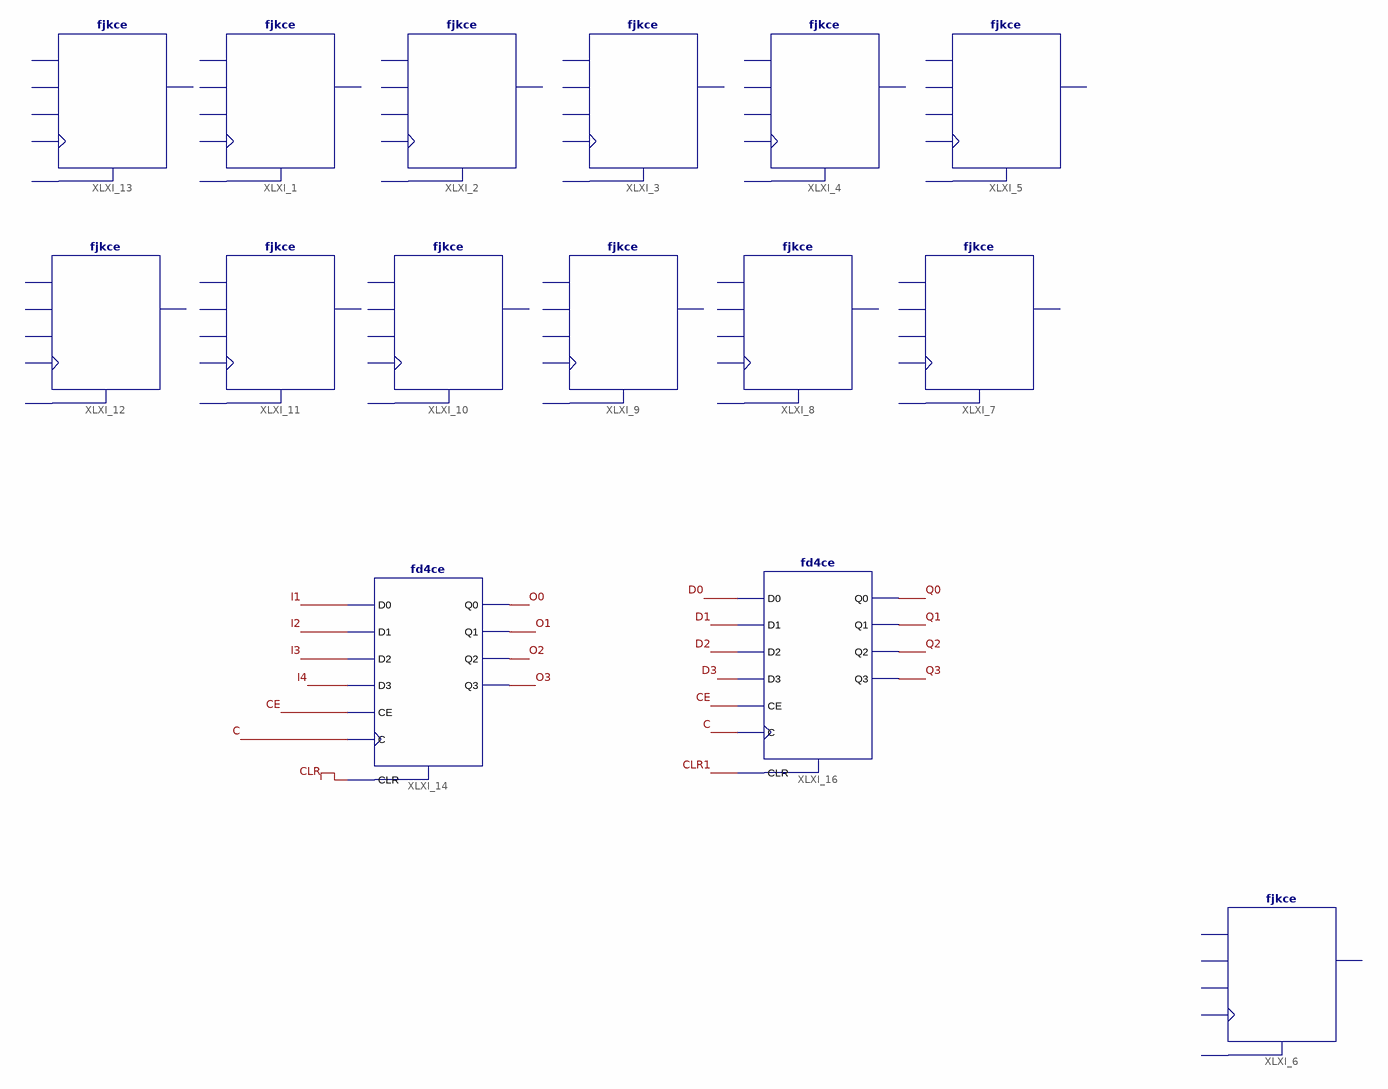
[diagram p0: schematic sheet 1]
// Xilinx ISE schematic inputProcessor.sch (spartan3e) as structural Verilog: 15 symbols, 0 ports
module inputProcessor (
);

  wire C, CE, CLR, CLR1, D0, D1, D2, D3, I1, I2, I3, I4, O0, O1, O2, O3, Q0, Q1, Q2, Q3;

  fjkce XLXI_1 ();  // open: C, CE, CLR, J, K, Q
  fjkce XLXI_2 ();  // open: C, CE, CLR, J, K, Q
  fjkce XLXI_3 ();  // open: C, CE, CLR, J, K, Q
  fjkce XLXI_4 ();  // open: C, CE, CLR, J, K, Q
  fjkce XLXI_5 ();  // open: C, CE, CLR, J, K, Q
  fjkce XLXI_7 ();  // open: C, CE, CLR, J, K, Q
  fjkce XLXI_8 ();  // open: C, CE, CLR, J, K, Q
  fjkce XLXI_9 ();  // open: C, CE, CLR, J, K, Q
  fjkce XLXI_10 ();  // open: C, CE, CLR, J, K, Q
  fjkce XLXI_11 ();  // open: C, CE, CLR, J, K, Q
  fjkce XLXI_12 ();  // open: C, CE, CLR, J, K, Q
  fjkce XLXI_13 ();  // open: C, CE, CLR, J, K, Q
  fd4ce XLXI_16 (.C(C), .CE(CE), .CLR(CLR1), .D0(D0), .D1(D1), .D2(D2), .D3(D3), .Q0(Q0), .Q1(Q1), .Q2(Q2), .Q3(Q3));
  fjkce XLXI_6 ();  // open: C, CE, CLR, J, K, Q
  fd4ce XLXI_14 (.C(C), .CE(CE), .CLR(CLR), .D0(I1), .D1(I2), .D2(I3), .D3(I4), .Q0(O0), .Q1(O1), .Q2(O2), .Q3(O3));
endmodule
